# Altium project Basic Arduino Shield.PrjPcb
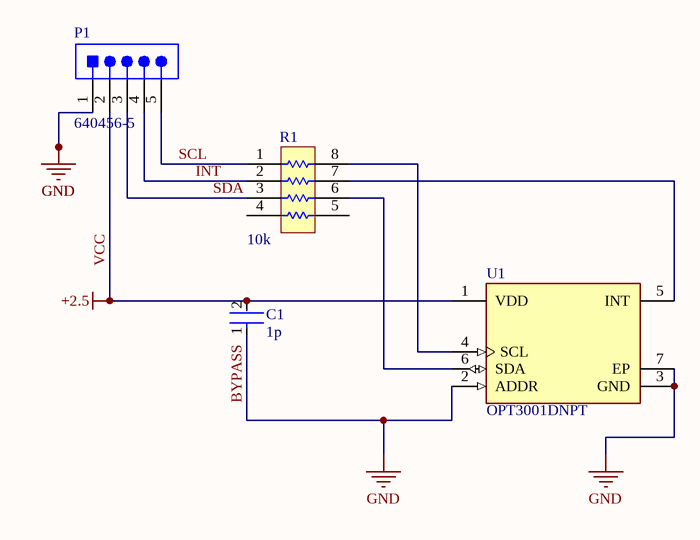
[diagram p0: Basic Arduino Shield.SchDoc]
1 sheet, 4 parts. Net scope: global (net labels, ports and power ports of the same name join across sheets).
Board file: Basic Arduino Shield.PcbDoc

## Sheet Basic Arduino Shield.SchDoc: Simple Light Sensor
size A; Author: Daniel A. Espinosa; DrawnBy: Daniel A. Espinosa; Engineer: Daniel A. Espinosa; DocumentNumber: 1; Revision: 1; SheetNumber: 1; SheetTotal: 1

### Parts
C1  1p  [FP-C0603C-CF-MFG]
P1  640456-5  [TECO-640456-5]
R1  10k  [BOUR-CAT16-103J4LF_L]
U1  OPT3001DNPT  [FP-DNP0006A-IPC_C]

### Nets
BYPASS: C1.1 P1.1(DTR) U1.2(ADDR) U1.3(GND) U1.7(EP)  [also labelled GND]
VCC: C1.2 P1.2(RXI) U1.1(VDD)  [also labelled +2.5]
INT: P1.4(VCC) R1.2
SCL: P1.5(CTS) R1.1
SDA: P1.3(TXO) R1.3
NetR1_6: R1.6 U1.6(SDA)
NetR1_7: R1.7 U1.5(INT)
NetR1_8: R1.8 U1.4(SCL)

Not connected (* = marked no-connect by the designer): R1 4 5

### Library data of the parts
C1 = CMP-2006-03328-2: CAP CER 1PF 50V C0G/NP0 0603 straight male header; Manufacturer: KEMET; Manufacturer Part Number: C0603C109C5GACTU; Value: 1.0 pF; Temperature Characteristic: C0G; Tolerance: 0.25 pF; Temperature Coefficient: 30ppm/°C; Description: C0603 1.0 pF C0G 30ppm/°C 0.25 pF 50 V; Automotive Grade: Grade 1; Material: Ceramic; Device Class L1: Passive Components; Temperature Range High: +125°C; Temperature: -55°C to +125°C; Height: 0.87mm; Digikey Description: CAP CER 1PF 50V C0G/NP0 0603; Voltage Rating: 50 V; ComponentLink2Description: Datasheet; Capacitance: 1.0 pF; Lead Free: Yes; ComponentLink2URL: https://api.kemet.com/component-edge/download/datasheet/C0603C100J5GACAUTO.pdf; Mouser Description: Multilayer Ceramic Capacitors MLCC - SMD/SMT 50volts 1.0pF C0G 0.25%; Temperature Range Low: -55°C; Device Class L3: Ceramic Capacitors; Device Class L2: Capacitors; Automotive: Yes; RoHS: TRUE; Package: C0603C-CF; Category: Cap; Octopart: https://octopart.com/c0603c109c5gactu-kemet-107248
P1 = CMP-1684-00014-1: Male Header, Pitch 2.54 mm, 1 x 5 Position, Height 10.03 mm, Tail Length 3.56 mm, / -55 to 105 degC, RoHS, Bulk; Manufacturer: TE Connectivity; Material, Housing: Polyester; Brand/Series: MTA-100Series; Color, Housing: White; Current, Rating: 5 / A; Temperature, Operating: -55to+105 / °C; Connector Type: MTA-100; Agency Approvals: CSA,UL; Material, Contact: CopperAlloy; Mounting Hole Size: 0.04 / "; Voltage, Rating: 250 / V; Contact Termination Area Plating: Tin; Pin Spacing: 0.1 / "; Primary Type: InterconnectSystem; Special Features: Pinstrip; Mount Angle: Vertical; Contact Centerline Spacing: 0.100 / in.; Number of Contacts: 5; Standards: RoHSCompliant,ELVCompliant,UL94V-0; Angle: Straight; Length, Terminal Post: 0.14 / in.; Manufacturer URL: http://www.te.com; Flammability Rating: UL94V-0; Mounting Type: PCMount; Termination: Solder; Package Reference: THD; Length, Overall: 0.5 / "; Contact Mating Area Plating: Tin; Length, Pin: 0.14 / "; Datasheet URL: http://sigma.octopart.com/77881742/technical_drawing/TE-Connectivity-640456-5.pdf; Package Description: Male Header, Pitch 2.54 mm, 1 x 5 Position, Height 10.03 mm, Tail Length 3.56 mm; Datasheet Version: Rev. W3; Contact Plating: Tin; Color: White; Number of Positions: 5; Type: PCBPlug; Contact Shape: Square; Number of Rows: 1; Size, Post: 0.025 / in.
R1 = CMP-2000-06067-1: CAT / CAY 16 Series - Chip Resistor Array, 10 KOhm, +/- 5%, 50 V, -55 to 125 degC, 8-Pin SMD, RoHS, Tape and Reel CAT16-103J4LF; Manufacturer: Bourns; Power Per Element: 62.5mW; Online Catalog: CAT16Series; Number of Resistors: 4; EDA / CAD Models: DownloadfromAcceleratedDesigns; Temperature Coefficient: ±200ppm/°C; Circuit Type: Isolated; Other Names: CAT16-103J4LFDKR; Package Reference: CAT16-103J4LF; Datasheet Version: 09/2014; Resistance (Ohms): 10k; Series: CAT16; Manufacturer URL: http://www.bourns.com/; Mounting Type: SurfaceMount; Datasheet URL: http://www.mouser.com/ds/2/54/ATCAY-777361.pdf; Category: Resistors; Height: 0.024"(0.60mm); Mounting Technology: SurfaceMount; Applications: -; Size / Dimension: 0.126"Lx0.061"W(3.20mmx1.55mm); Packaging: Digi-Reel®; Package / Case: 1206(3216Metric),Concave,LongSideTerminals; Supplier Device Package: 1206; RoHS Information: CAT16MaterialDeclaration; Number of Pins: 8; Family: ResistorNetworks,Arrays; Standard Package: 1; Package Description: 8-Pin Surface Mount Device, Body 3.2 x 1.55 mm, Pitch 0.8 mm; Operating Temperature: -55°C~125°C; Tolerance: ±5%
U1 = CMP-2000-06867-2: SENSOR OPT 550NM AMBIENT 6USON; Min Supply Voltage: 1.6V; Output Type: I2C; Max Supply Voltage: 3.6V; Sensing Method: Optical; Max Frequency: 2.6MHz; Min Operating Temperature: -40°C; REACH SVHC: No SVHC; Max Operating Temperature: 85°C; Mount: Surface Mount; Packaging: Cut Tape; Number of Pins: 6; Interface: I2C; Contact Plating: Gold; Lead Free: Lead Free; Wavelength: 550nm